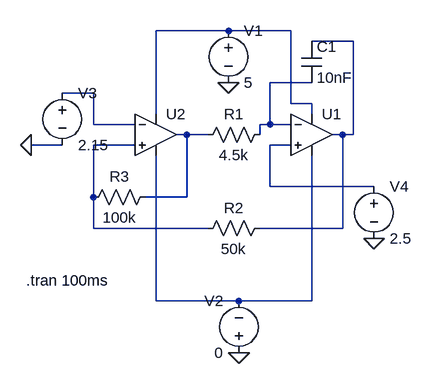
[diagram p0: schematic Draft1.asc]
Draft1.asc, the LTspice schematic file:
Version 4
SHEET 1 880 680
WIRE 176 -16 64 -16
WIRE 272 -16 176 -16
WIRE 368 0 304 0
WIRE 304 64 240 64
WIRE -32 80 -80 80
WIRE 272 96 272 -16
WIRE 304 96 272 96
WIRE 64 112 64 -16
WIRE 304 112 304 96
WIRE -32 128 -32 80
WIRE 32 128 -32 128
WIRE 240 128 240 64
WIRE 240 128 224 128
WIRE 272 128 240 128
WIRE 112 144 96 144
WIRE 144 144 112 144
WIRE 224 144 224 128
WIRE 352 144 336 144
WIRE 368 144 368 0
WIRE 368 144 352 144
WIRE -80 160 -128 160
WIRE 32 160 -32 160
WIRE 272 160 240 160
WIRE 240 224 240 160
WIRE 400 224 240 224
WIRE -32 240 -32 160
WIRE 112 240 112 144
WIRE 112 240 48 240
WIRE -32 288 -32 240
WIRE 144 288 -32 288
WIRE 352 288 352 144
WIRE 352 288 224 288
WIRE 64 400 64 176
WIRE 192 400 64 400
WIRE 304 400 304 176
WIRE 304 400 192 400
FLAG -128 160 0
FLAG 400 304 0
FLAG 192 480 0
FLAG 176 64 0
SYMBOL res 240 128 R90
WINDOW 0 0 56 VBottom 2
WINDOW 3 32 56 VTop 2
SYMATTR InstName R1
SYMATTR Value 4.5k
SYMBOL res 240 272 R90
WINDOW 0 0 56 VBottom 2
WINDOW 3 32 56 VTop 2
SYMATTR InstName R2
SYMATTR Value 50k
SYMBOL res 64 224 R90
WINDOW 0 0 56 VBottom 2
WINDOW 3 32 56 VTop 2
SYMATTR InstName R3
SYMATTR Value 100k
SYMBOL cap 288 0 R0
SYMATTR InstName C1
SYMATTR Value 10nF
SYMBOL voltage 176 -32 R0
WINDOW 123 0 0 Left 0
WINDOW 39 0 0 Left 0
SYMATTR InstName V1
SYMATTR Value 5
SYMBOL voltage 192 496 R180
WINDOW 0 24 96 Left 2
WINDOW 3 24 16 Left 2
WINDOW 123 0 0 Left 0
WINDOW 39 0 0 Left 0
SYMATTR InstName V2
SYMATTR Value 0
SYMBOL voltage -80 64 R0
WINDOW 123 0 0 Left 0
WINDOW 39 0 0 Left 0
SYMATTR InstName V3
SYMATTR Value 2.15
SYMBOL voltage 400 208 R0
WINDOW 123 0 0 Left 0
WINDOW 39 0 0 Left 0
SYMATTR InstName V4
SYMATTR Value 2.5
SYMBOL OpAmps\\UniversalOpAmp2 304 144 R0
SYMATTR InstName U1
SYMBOL OpAmps\\UniversalOpAmp2 64 144 R0
SYMATTR InstName U2
TEXT -136 368 Left 2 !.tran 100ms

The netlist it stands for:
* Draft1.asc
R1 N003 N005 4.5k
R2 N002 N006 50k
R3 N005 N006 100k
C1 N002 N003 10nF
V1 N001 0 5
V2 0 N008 0
V3 N004 0 2.15
V4 N007 0 2.5
XU1 N007 N003 N001 N008 N002 level2 Avol=1Meg GBW=10Meg Slew=10Meg Ilimit=25m Rail=0 Vos=0 En=0 Enk=0 In=0 Ink=0 Rin=500Meg  ; pins In+ In- V+ V- OUT
XU2 N006 N004 N001 N008 N005 level2 Avol=1Meg GBW=10Meg Slew=10Meg Ilimit=25m Rail=0 Vos=0 En=0 Enk=0 In=0 Ink=0 Rin=500Meg  ; pins In+ In- V+ V- OUT
.tran 100ms
.lib UniversalOpAmp2.lib
.backanno
.end